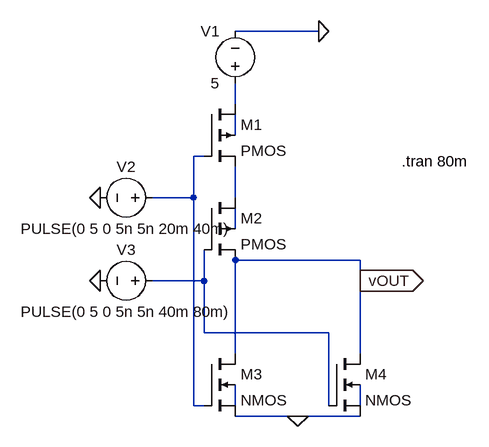
[diagram p0: schematic NOR.asc]
NOR.asc, the LTspice schematic file:
Version 4
SHEET 1 880 680
WIRE -256 -320 -384 -320
WIRE -384 -208 -384 -240
WIRE -384 -160 -384 -192
WIRE -432 -128 -448 -128
WIRE -448 -64 -448 -128
WIRE -448 -64 -512 -64
WIRE -384 -64 -384 -112
WIRE -384 -16 -384 -48
WIRE -192 32 -384 32
WIRE -432 64 -432 16
WIRE -432 64 -512 64
WIRE -192 64 -192 32
WIRE -432 144 -432 64
WIRE -240 144 -432 144
WIRE -384 176 -384 32
WIRE -192 176 -192 64
WIRE -448 256 -448 -64
WIRE -432 256 -448 256
WIRE -384 256 -384 224
WIRE -240 256 -240 144
WIRE -192 256 -192 224
WIRE -288 272 -384 272
WIRE -192 272 -288 272
FLAG -256 -320 0
FLAG -288 272 0
FLAG -192 64 vOUT
IOPIN -192 64 Out
FLAG -592 -64 0
FLAG -592 64 0
SYMBOL pmos4 -432 -208 R0
SYMATTR InstName M1
SYMBOL pmos4 -432 -64 R0
SYMATTR InstName M2
SYMBOL nmos4 -432 176 R0
SYMATTR InstName M3
SYMBOL nmos4 -240 176 R0
SYMATTR InstName M4
SYMBOL voltage -384 -224 R180
WINDOW 0 24 96 Left 2
WINDOW 3 24 16 Left 2
WINDOW 123 0 0 Left 0
WINDOW 39 0 0 Left 0
SYMATTR InstName V1
SYMATTR Value 5
SYMBOL voltage -496 -64 R90
WINDOW 0 -32 56 VBottom 2
WINDOW 3 32 56 VTop 2
WINDOW 123 0 0 Left 0
WINDOW 39 0 0 Left 0
SYMATTR InstName V2
SYMATTR Value PULSE(0 5 0 5n 5n 20m 40m)
SYMBOL voltage -496 64 R90
WINDOW 0 -32 56 VBottom 2
WINDOW 3 32 56 VTop 2
WINDOW 123 0 0 Left 0
WINDOW 39 0 0 Left 0
SYMATTR InstName V3
SYMATTR Value PULSE(0 5 0 5n 5n 40m 80m)
TEXT -128 -120 Left 2 !.tran 80m

The netlist it stands for:
* NOR.asc
M1 N001 N003 N004 N002 PMOS
M2 N004 N006 vOUT N005 PMOS
M3 vOUT N003 0 N007 NMOS
M4 vOUT N006 0 N008 NMOS
V1 N001 0 5
V2 N003 0 PULSE(0 5 0 5n 5n 20m 40m)
V3 N006 0 PULSE(0 5 0 5n 5n 40m 80m)
.model NMOS NMOS
.model PMOS PMOS
.lib standard.mos
.tran 80m
.backanno
.end